# EAGLE design gpsfreq (EAGLE 7.2.0)
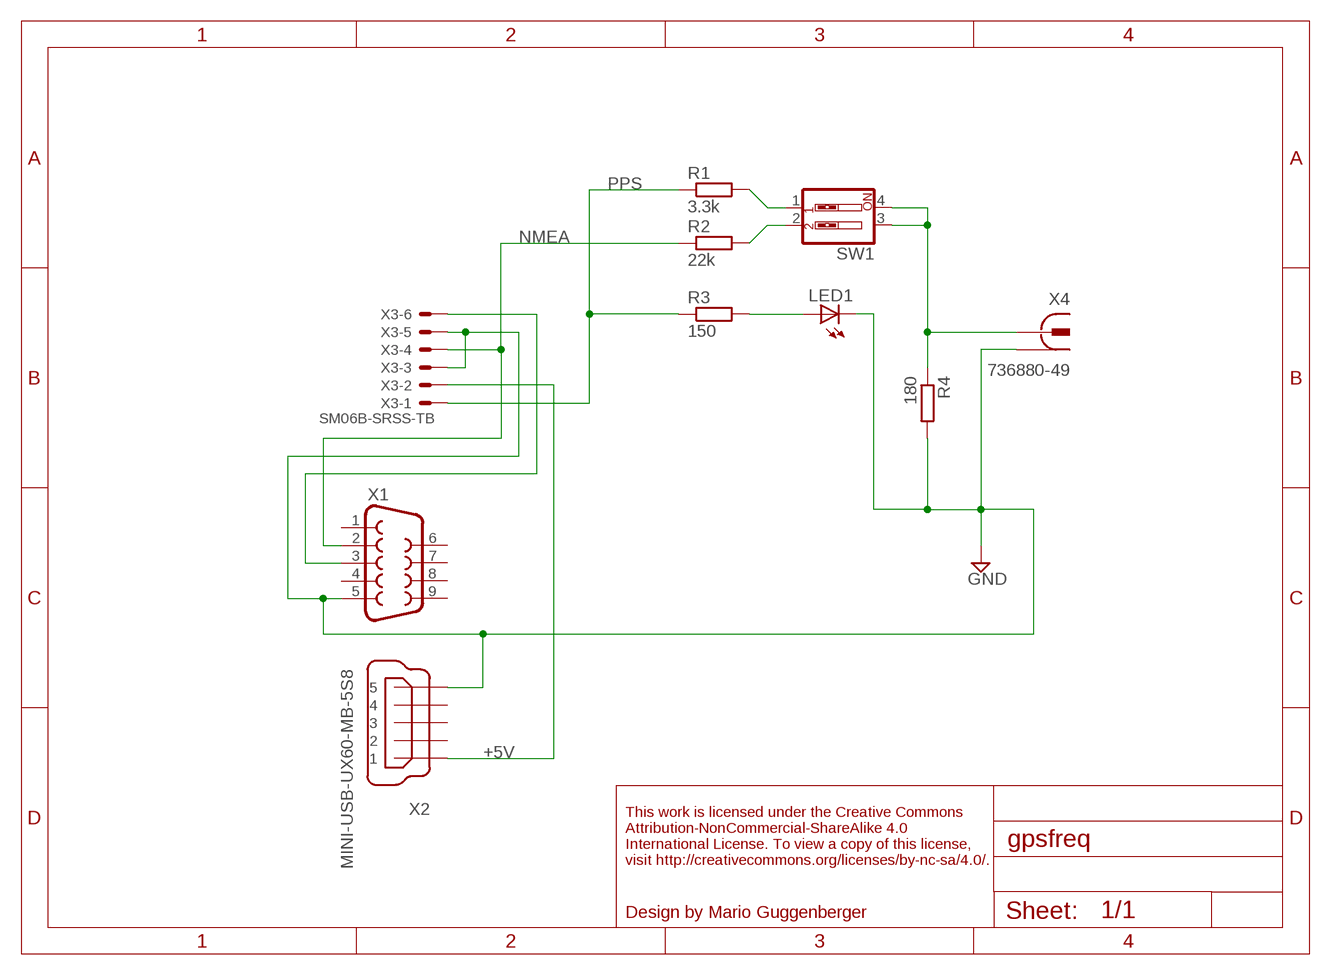
[diagram p0: schematic, sheet 1]

## Parts
LED1  LED3MM  [LED3MM]
R1  3.3k  R-EU_0204_7  [0204/7]
R2  22k  R-EU_0204_7  [0204/7]
R3  150  R-EU_0204_7  [0204/7]
R4  180  R-EU_0204_7  [0204/7]
SW1  SW_DIP-2  [EDG-02]
X1  F09H  [F09H]
X2  MINI-USB-UX60-MB-5S8  [UX60-MB-5S8]
X3  SM06B-SRSS-TB  [SM06B-SRSS-TB]
X4  736880-49  [736880-49]

## Nets
+5V: X2.1 X3.2
GND: LED1.K(C) R4.2 X1.5 X2.5 X3.3 X3.5 X4.1 X4.1@1 X4.1@2
N$1: LED1.A R3.2
N$2: R4.1 SW1.3 SW1.4 X4.2
N$4: R1.2 SW1.1
N$5: R2.2 SW1.2
N$7: X1.3 X3.6
NMEA: R2.1 X1.2 X3.4
PPS: R1.1 R3.1 X3.1
Unconnected: X1.1 X1.4 X1.6 X1.7 X1.8 X1.9 X2.2 X2.3 X2.4

## Notes on the sheet
- This work is licensed under the Creative Commons
  Attribution-NonCommercial-ShareAlike 4.0
  International License. To view a copy of this license,
  visit http://creativecommons.org/licenses/by-nc-sa/4.0/.
- Design by Mario Guggenberger

## Library data of the parts
LED1 = led:LED: LED OSRAM: - CHIPLED LG R971, LG N971, LY N971, LG Q971, LY Q971, LO R971, LY R971 LH N974, LH R974 LS Q976, LO Q976, LY Q976 LO Q996 - Hyper CHIPLED LW Q18S LB Q993, LB Q99A, LB R99A - SideLED LS A670, LO A670, LY A670, LG A670, LP A670 LB A673, LV A673, LT A673, LW A673 LH A674 LY A675 LS A676, LA A676, LO A676, LY A676, LW A676 LS A679, LY A679, LG A679 - Hyper Micro SIDELED® LS Y876, LA Y876, LO Y876, LY Y876 LT Y87S - SmartLED LW L88C, LW L88S LB L89C, LB L89S, LG L890 LS L89K, LO L89K, LY L89K LS L896, LA L896, LO L896, LY L896 - TOPLED LS T670, LO T670, LY T670, LG T670, LP T670 LSG T670, LSP T670, LSY T670, LOP T670, LYG T670 LG T671, LOG T671, LSG T671 LB T673, LV T673, LT T673, LW T673 LH T674 LS T676, LA T676, LO T676, LY T676, LB T676, LH T676, LSB T676, LW T676 LB T67C, LV T67C, LT T67C, LS T67K, LO T67K, LY T67K, LW E67C LS E67B, LA E67B, LO E67B, LY E67B, LB E67C, LV E67C, LT E67C LW T67C LS T679, LY T679, LG T679 LS T770, LO T770, LY T770, LG T770, LP T770 LB T773, LV T773, LT T773, LW T773 LH T774 LS E675, LA E675, LY E675, LS T675 LS T776, LA T776, LO T776, LY T776, LB T776 LHGB T686 LT T68C, LB T68C - Hyper Mini TOPLED® LB M676 - Mini TOPLED Santana® LG M470 LS M47K, LO M47K, LY M47K Source: http://www.osram.convergy.de LUXEON: - LUMILED® LXK2-PW12-R00, LXK2-PW12-S00, LXK2-PW14-U00, LXK2-PW14-V00 LXK2-PM12-R00, LXK2-PM12-S00, LXK2-PM14-U00 LXK2-PE12-Q00, LXK2-PE12-R00, LXK2-PE12-S00, LXK2-PE14-T00, LXK2-PE14-U00 LXK2-PB12-K00, LXK2-PB12-L00, LXK2-PB12-M00, LXK2-PB14-N00, LXK2-PB14-P00, LXK2-PB14-Q00 LXK2-PR12-L00, LXK2-PR12-M00, LXK2-PR14-Q00, LXK2-PR14-R00 LXK2-PD12-Q00, LXK2-PD12-R00, LXK2-PD12-S00 LXK2-PH12-R00, LXK2-PH12-S00 LXK2-PL12-P00, LXK2-PL12-Q00, LXK2-PL12-R00 Source: www.luxeon.com KINGBRIGHT: KA-3528ASYC Source: www.kingbright.com
R1-R4 = resistor:R-EU_: RESISTOR, European symbol; SPICEPREFIX: R
SW1 = special:SW_DIP-2: DIP SWITCH
X1 = con-subd:F09: SUB-D; OC_FARNELL: unknown; OC_NEWARK: unknown
X2 = con-hirose:MINI-USB-: MINI USB Connector Source: http://www.hirose.co.jp/cataloge_hp/e24000019.pdf; OC_FARNELL: unknown; OC_NEWARK: unknown
X3 = con-jst2:?M06B-SRSS-TB: Disconnectable Crimp style connector, 1.0mm pitch 6 contacts
X4 = con-conrad:736880-49: Cinch Connector ( RCA Jack ) Cinch-Einbaukupplung 90º 72345 Vernickelt BKL Electronic Source: Conrad <http://www.conrad.de/ce/de/product/736880>

## Board
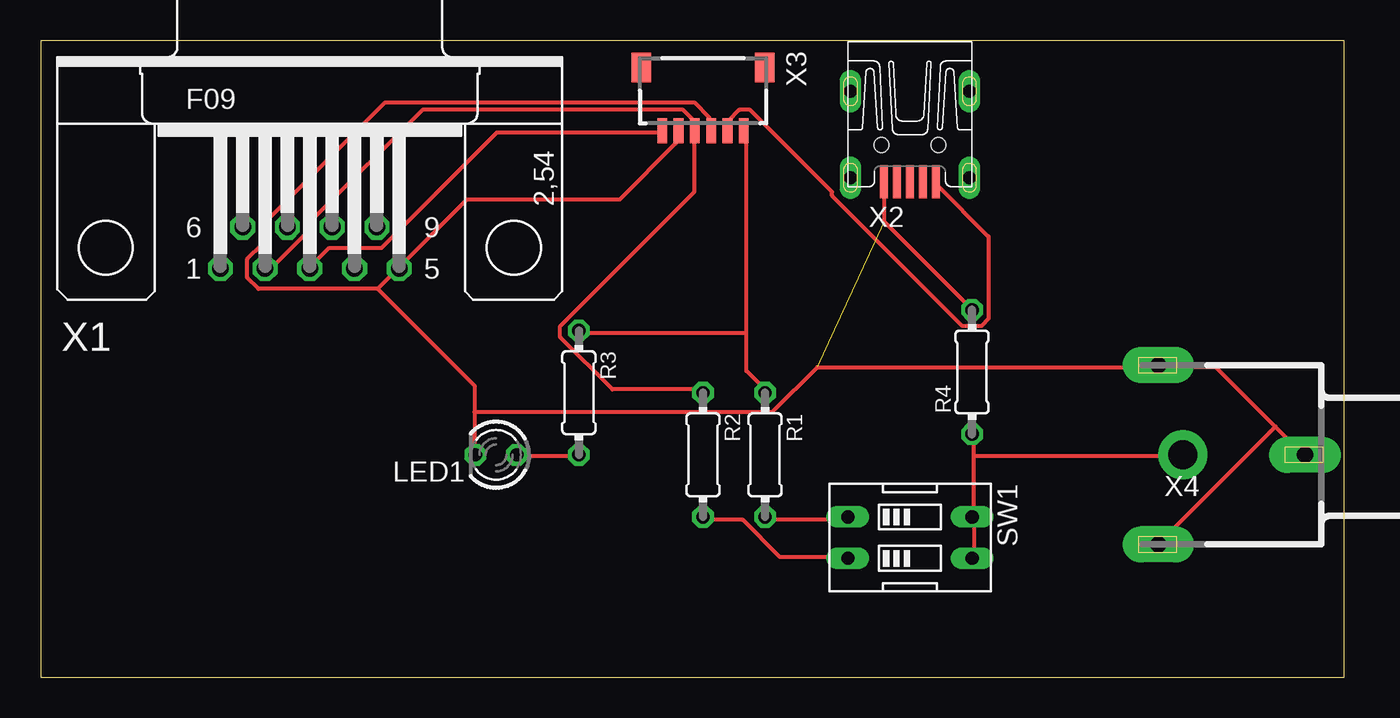
[diagram p1: board, top side]

Size 80 x 39.04 mm. Coordinates in mm from the lower left corner, seen from the top.
Outline: 0,39.04 0,0 80,0 80,39.04 0,39.04
Copper layers (1*16): Top 0.035mm / dielectric 1.5mm / Bottom 0.035mm
Design rules "default": minimum track width 10mil, minimum drill 24mil, track to track 8mil, track to pad 8mil, pad to pad 8mil, via to via 8mil, smd to smd 8mil, copper to edge 40mil, drill to drill 8mil, minimum pad ring 10mil, minimum via ring 8mil, stop-mask expansion 4mil, vias tented up to drill 0mil, thermal gap 10mil

### Footprints (pad centres in the part's own frame; a part is rotated, then mirrored left to right if it is on the bottom)
LED3MM = drill 0.813 octagon: A -1.27,0; K 1.27,0
0204/7 = drill 0.813 octagon: 1 -3.81,0; 2 3.81,0
EDG-02 = drill 0.813 long: 1 -1.27,-3.81; 2 1.27,-3.81; 3 1.27,3.81; 4 -1.27,3.81
F09H = drill 1.016 octagon: 1 -5.486,-1.27; 2 -2.743,-1.27; 3 0,-1.27; 4 2.743,-1.27; 5 5.486,-1.27; 6 -4.115,1.27; 7 -1.372,1.27; 8 1.372,1.27; 9 4.115,1.27 | hole 3.302: -12.522,0; 12.522,0
UX60-MB-5S8 = smd 2 x 0.5: 1 8.65,1.6; 2 8.65,0.8; 3 8.65,0; 4 8.65,-0.8; 5 8.65,-1.6 | drill 0.8 long: M1 3.1,-3.65; M2 3.1,3.65; M3 8.4,3.65; M4 8.4,-3.65 | hole 0.9: 6.4,-1.75; 6.4,1.75
SM06B-SRSS-TB = smd 0.6 x 1.55: 1 -2.5,2.975; 2 -1.5,2.975; 3 -0.5,2.975; 4 0.5,2.975; 5 1.5,2.975; 6 2.5,2.975 | smd 1.2 x 1.8: FIT@1 -3.8,-0.9; FIT@2 3.8,-0.9
736880-49 = drill 1 pad 2.2 long: 1 -3.92,0; 1@1 5.08,-5.5; 1@2 5.08,5.5 | drill 1.8 pad 3: 2 3.58,0

### Placement (x,y rotation side)
LED1  27.94,13.64 180 top
R1  44.45,13.64 270 top
R2  40.64,13.64 270 top
R3  33.02,17.45 270 top
R4  57.15,18.72 90 top
SW1  53.34,8.56 270 top
U$1  [A5L-LOC]  -49.53,-47.32 0 top  (outside the outline)
X1  16.51,26.34 0 top
X2  53.34,39.04 270 top
X3  40.64,36.5 180 top
X4  73.66,13.64 180 top

### Tracks (layer width: path | path; a pad name or v marks a point on that pad's centre or on a via)
+5V
  Top 0.254: X3.2 42.16,33.66 42.16,34.11 42.85,34.8 43.54,34.8 48.56,29.77 48.56,29.54 56.57,21.54 57.71,21.54 58.17,22 58.17,27.03 54.97,30.23 X2.1
GND  (1 unrouted)
  Top 0.254: X2.5 51.76,30.23 51.76,27.94 57.02,22.68 R4.2 | 75.77,15.37 77.37,13.77 X4.1 | 75.77,15.37 72.11,19.02 68.68,19.02 X4.1@1 68.45,19.02 47.65,19.02 44.91,16.28 26.62,16.28 | 75.77,15.37 68.68,8.28 X4.1@2 | X3.5 38.96,33.43 38.96,32.74 35.53,29.31 26.16,29.31 22.05,25.2 X1.5 21.82,24.97 20.68,23.82 | 20.68,23.82 13.36,23.82 12.68,24.51 12.68,25.65 13.59,26.57 13.59,27.71 21.13,35.25 40.11,35.25 41.02,34.34 41.02,33.66 X3.3 | 26.62,16.28 26.62,17.88 20.68,23.82 | 26.62,16.28 26.62,13.77 LED1.K
N$1
  Top 0.254: LED1.A 29.36,13.54 33.02,13.54 R3.2
N$2
  Top 0.254: 57.25,13.54 57.25,9.88 SW1.4 57.25,9.65 57.25,7.37 SW1.3 | 57.25,13.54 57.25,14.91 R4.1 | 57.25,13.54 70.05,13.54 X4.2
N$4
  Top 0.254: R1.2 44.45,9.65 49.48,9.65 SW1.1
N$5
  Top 0.254: R2.2 40.79,9.65 43.08,9.65 45.36,7.37 49.48,7.37 SW1.2
N$7
  Top 0.254: X3.6 38.05,33.43 27.99,33.43 20.9,26.34 17.7,26.34 16.56,25.2 X1.3
NMEA
  Top 0.254: R2.1 40.56,17.65 35.08,17.65 31.88,20.85 31.88,21.54 40.11,29.77 40.11,33.43 X3.4 40.11,33.66 40.11,34.11 39.42,34.8 23.42,34.8 16.79,28.17 16.79,27.71 14.28,25.2 13.82,25.2 X1.2
PPS
  Top 0.254: 43.31,21.08 43.31,18.8 44.45,17.65 R1.1 | 43.31,21.08 43.31,33.43 X3.1 | 43.31,21.08 33.02,21.08 R3.1

### Text on the board
Document: This work is licensed under the Creative Commons / Attribution-NonCommercial-ShareAlike 4.0 / International License. To view a copy of this license, / visit http://creativecommons.org/licenses/by-nc-sa/4.0/. | Design by Mario Guggenberger